# Altium schematic sheet Inputs.SchDoc
size 420 x 297 mm; SheetNumber: 11; SheetTotal: 11
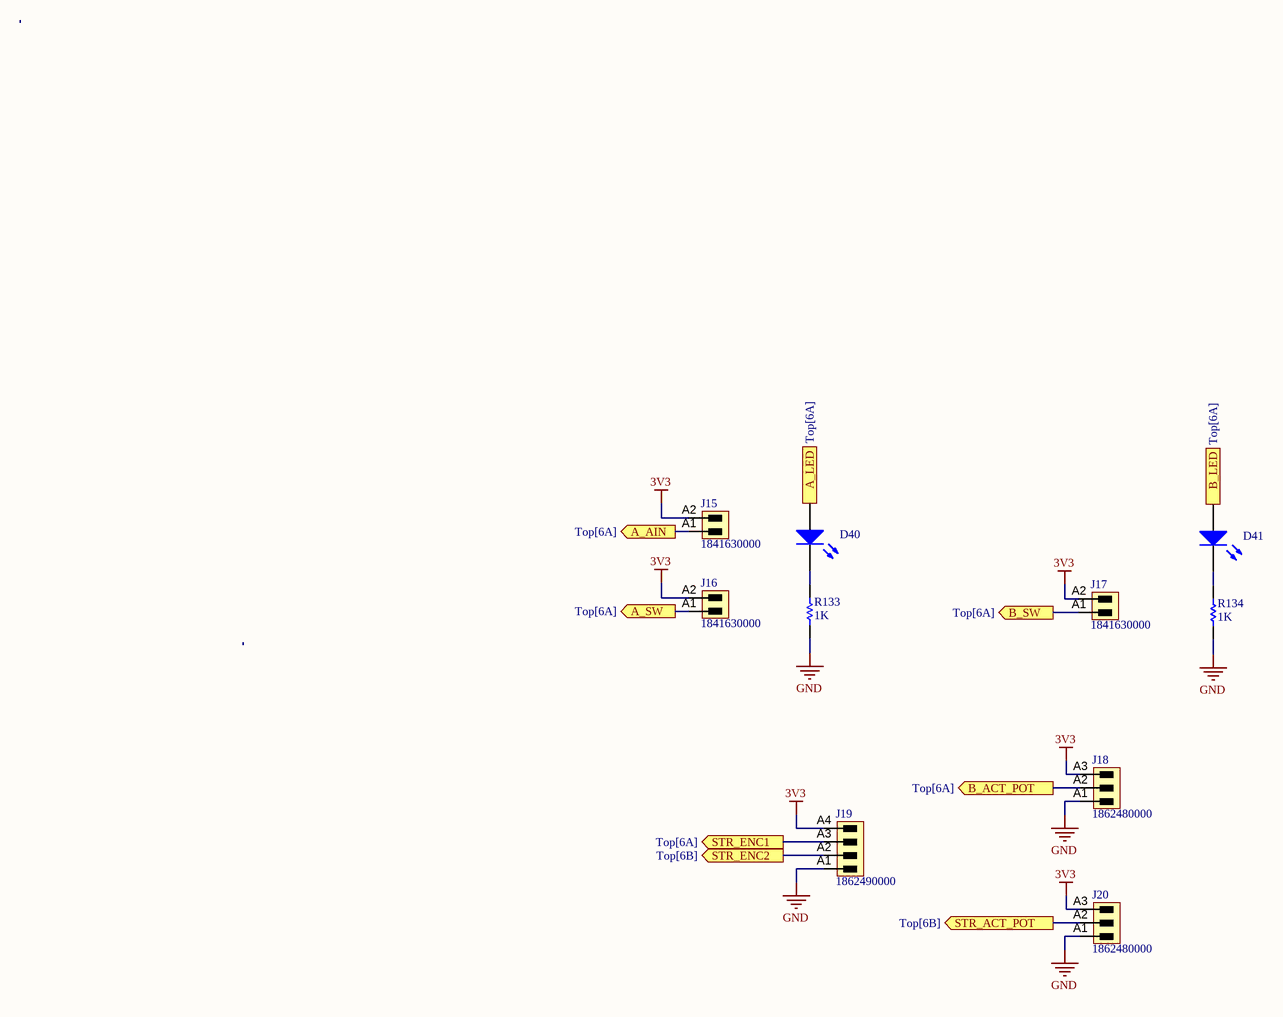
[diagram p0: Inputs.SchDoc]

## Parts
D40  Light-Emitting Diode  (value not drawn)
D41  Light-Emitting Diode  (value not drawn)
J15  1841630000  [SL_SMT_3_5_90G_02]
J16  1841630000  [SL_SMT_3_5_90G_02]
J17  1841630000  [SL_SMT_3_5_90G_02]
J18  1862480000  [SC_SMT_3_81_90G_03]
J19  1862490000  [SC_SMT_3_81_90G_04]
J20  1862480000  [SC_SMT_3_81_90G_03]
R133  value 1K  (hidden comment: Resistor)
R134  value 1K  (hidden comment: Resistor)

## Ports
A_AIN (out, see Top[6A]), A_LED (in, see Top[6A]), A_SW (out, see Top[6A]), B_ACT_POT (out, see Top[6A]), B_LED (in, see Top[6A]), B_SW (out, see Top[6A]), STR_ACT_POT (out, see Top[6B]), STR_ENC1 (out, see Top[6A]), STR_ENC2 (out, see Top[6B])

## Nets
3V3: J15.A2 J16.A2 J17.A2 J18.A3 J19.A4 J20.A3
GND: J18.A1 J19.A1 J20.A1 R133.2 R134.2
A_AIN: J15.A1 ; port A_AIN
A_LED: D40.1(A) ; port A_LED
A_SW: J16.A1 ; port A_SW
B_ACT_POT: J18.A2 ; port B_ACT_POT
B_LED: D41.1(A) ; port B_LED
B_SW: J17.A1 ; port B_SW
STR_ACT_POT: J20.A2 ; port STR_ACT_POT
STR_ENC1: J19.A3 ; port STR_ENC1
STR_ENC2: J19.A2 ; port STR_ENC2
NetD40_2: D40.2(K) R133.1
NetD41_2: D41.2(K) R134.1

## Notes on the sheet
- THIS DOCUMENT AND THE DATA DISCLOSED HEREIN OR
- HEREWITH IS THE PROPERTY OF ALTIUM LIMITED AND MAY
- DWG NO:
- REVISION
- REV:
- DESCRIPTION
- DATE
- APPROVED
- BE FREELY DISTRIBUTED IN WHOLE. NO RIGHTS ARE
- RESERVED OR EXPRESS OR IMPLIED WARANTEE GIVEN.
- ENG:
- APPROVALS
- PROJECT
- DSN:
- CHK:
- REFERENCE DOCUMENTS
- PROJECT REVISION:
- TITLE
- DOCUMENT REVISION:
- DESIGN ITEM:
- BOM:
- FAB DWG:
- PCB DWG:
- ASSY DWG:
- SCALE:
- A3
- SIZE
- CAGE CODE
- FILE NAME
- DWG NO.
- SHEET
- OF
- REV

## Library data of the parts
D40 D41 = LED: AF: 1; BV: 0; BV_MAX: 1e99; EG: 1.11; FC: 0.5; IBV: 0.001; IS: 1e-14; MJSW: 0.33; NTUN: 30; TNOM: 27; XTI: 3; SimulationGenericComponent: True; CJO: 0; CJP: 0; CTA: 0; CTP: 0; FCS: 0.5; FV_MAX: 1e99; IKF: 0; IKR: 0; ISR: 1e-14; JSW: 0; JTUN: 0; JTUNSW: 0; KEG: 1; KF: 0; LEVEL: 1; N: 1; NBV: 1; NR: 1; NS: 1; PHP: 1; RS: 0; TCV: 0; TLEV: 0; TLEVC: 0; TM1: 0; TM2: 0; TPB: 0; TPHP: 0; TRS: 0; TRS2: 0; TT: 0; TTT1: 0; TTT2: 0; VJ: 1; XTITUN: 3
J15-J17 = CMP-1559-01184-1: OMNIMATE Signal - series BL/SL 3.50; Manufacturer: Weidmueller; Rated_voltage_use_group_B_UL_1059: 300 V; Mounting_onto_the_PCB: Reflow solder connection; Rated_current_min_no_of_poles_TU_20_deg_C: 15 A; Pitch_mm: 3.5 mm; Insulating_material: LCP GF; Pitch_inch: 0.138 inch; Rated_voltage_for_surge_voltage_class_pollution_degree_II_2: 320 V; Short_text_for_material: SL-SMT 3.50/02/90G 3.2SN BK BX; No_of_poles: 2; Contact_surface: tinned; Side_termination_characteristic: closed side; Rated_current_use_group_B_UL_1059: 10 A; UL_94_flammability_rating: V-0; Outgoing_elbow: 90°; Solder_pin_length_mm: 3.2 mm; Revision: V1; Qty: 100 PCS; ComponentLink2URL: http://catalog.weidmueller.com/catalog/Start.do?localeId=en&ObjectID=1841630000; Packaging: Box; Colour: Black; PackageReference: SL_SMT_3_5_90G_02; PartNumber: 1841630000; ComponentLink1Description: Manufacturer URL; ComponentLink1URL: http://www.weidmueller.com/; ComponentLink2Description: URL Link1
J18 J20 = CMP-1559-00516-1: OMNIMATE Signal - series BC/SC 3.81; Manufacturer: Weidmueller; Rated_current_use_group_B_UL_1059: 10 A; Rated_voltage_for_surge_voltage_class_pollution_degree_II_2: 320 V; Contact_surface: tinned; Outgoing_elbow: 90°; Rated_voltage_use_group_B_UL_1059: 300 V; Solder_pin_length_mm: 3.2 mm; UL_94_flammability_rating: V-0; Rated_current_min_no_of_poles_TU_20_deg_C: 19 A; Insulating_material: LCP GF; Mounting_onto_the_PCB: Reflow solder connection; No_of_poles: 3; Short_text_for_material: SC-SMT 3.81/03/90G 3.2SN BK BX; Contact_material: Cu-Leg; Pitch_inch: 0.15 inch; Side_termination_characteristic: closed side; Pitch_mm: 3.81 mm; Revision: V1; ComponentLink1URL: http://www.weidmueller.com/; ComponentLink2Description: URL Link1; ComponentLink1Description: Manufacturer URL; Colour: Black; ComponentLink2URL: http://catalog.weidmueller.com/catalog/Start.do?localeId=en&ObjectID=1862480000; PartNumber: 1862480000; Packaging: Box; PackageReference: SC_SMT_3_81_90G_03; Qty: 50 PCS
J19 = CMP-1559-00524-1: OMNIMATE Signal - series BC/SC 3.81; Manufacturer: Weidmueller; Side_termination_characteristic: closed side; Pitch_mm: 3.81 mm; UL_94_flammability_rating: V-0; Outgoing_elbow: 90°; Rated_voltage_use_group_B_UL_1059: 300 V; No_of_poles: 4; Rated_current_min_no_of_poles_TU_20_deg_C: 19 A; Rated_current_use_group_B_UL_1059: 10 A; Solder_pin_length_mm: 3.2 mm; Contact_surface: tinned; Contact_material: Cu-Leg; Rated_voltage_for_surge_voltage_class_pollution_degree_II_2: 320 V; Mounting_onto_the_PCB: Reflow solder connection; Short_text_for_material: SC-SMT 3.81/04/90G 3.2SN BK BX; Insulating_material: LCP GF; Pitch_inch: 0.15 inch; ComponentLink2Description: URL Link1; Qty: 50 PCS; Colour: Black; ComponentLink1URL: http://www.weidmueller.com/; Packaging: Box; PackageReference: SC_SMT_3_81_90G_04; ComponentLink1Description: Manufacturer URL; ComponentLink2URL: http://catalog.weidmueller.com/catalog/Start.do?localeId=en&ObjectID=1862490000; PartNumber: 1862490000; Revision: V1
R133 R134 = Resistor: TC1: 0; SimulationGenericComponent: True; TC2: 0